# Altium schematic sheet MIC&Speaker.SchDoc
size A4
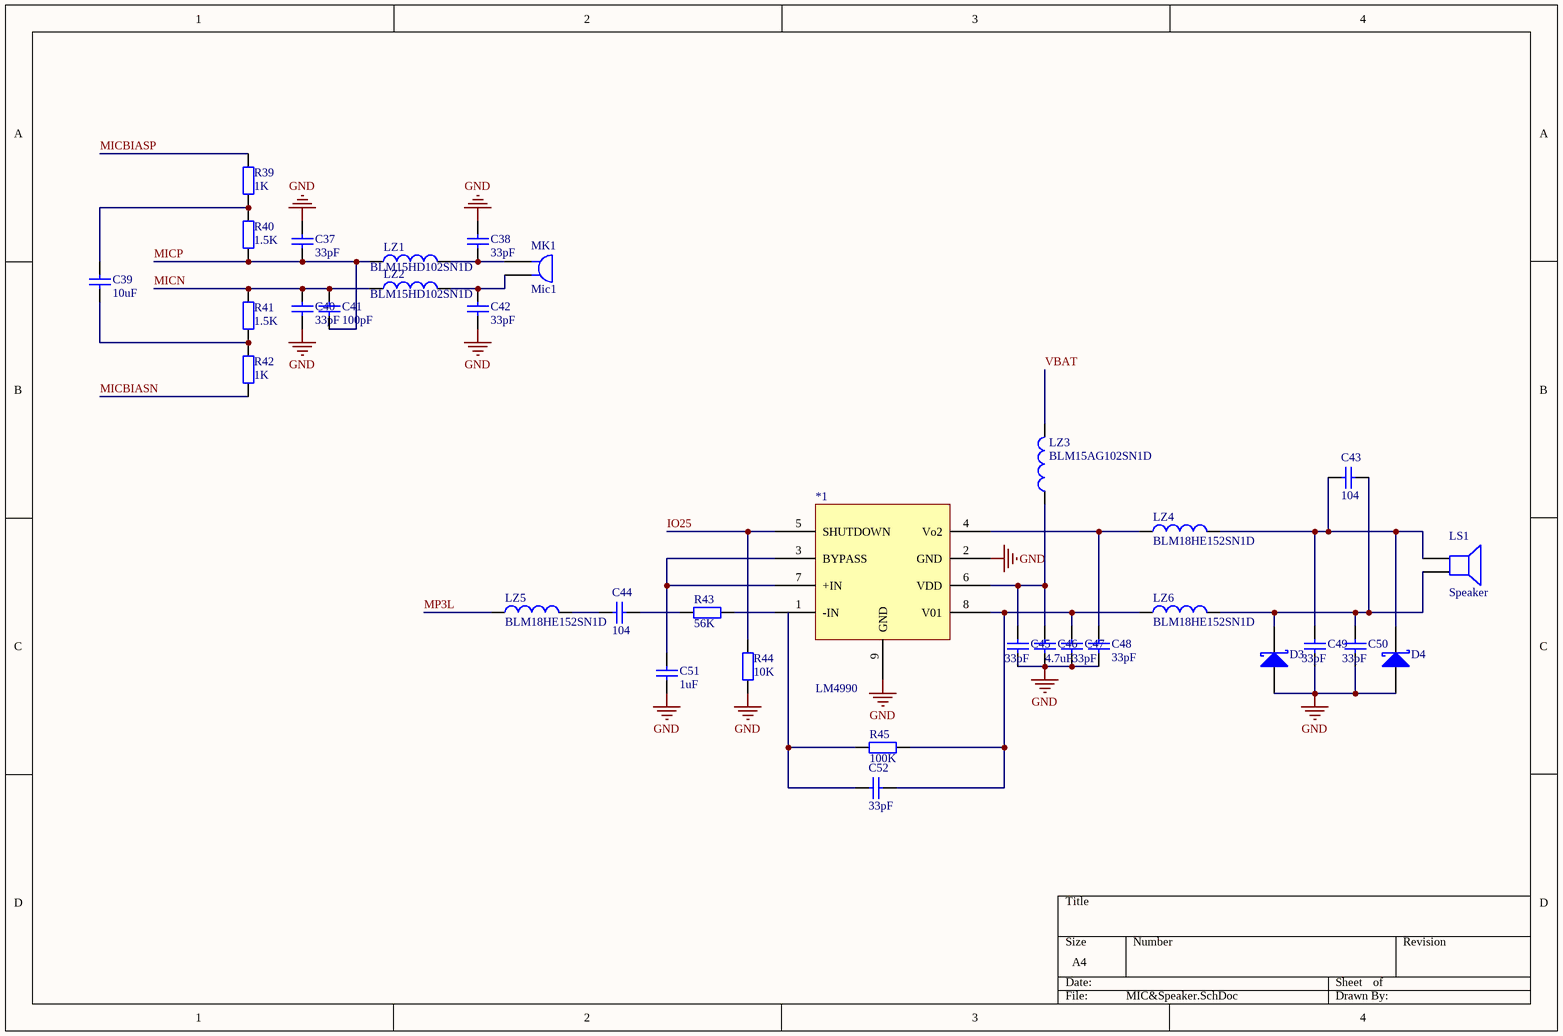
[diagram p0: MIC&Speaker.SchDoc]

## Parts
*1  LM4990
C37  value 33pF  [1608[0603]]  (hidden comment: Cap)
C38  value 33pF  [1608[0603]]  (hidden comment: Cap)
C39  value 10uF  [1608[0603]]  (hidden comment: Cap)
C40  value 33pF  [1608[0603]]  (hidden comment: Cap)
C41  value 100pF  [1608[0603]]  (hidden comment: Cap)
C42  value 33pF  [1608[0603]]  (hidden comment: Cap)
C43  value 104  [1608[0603]]  (hidden comment: Cap)
C44  value 104  [1608[0603]]  (hidden comment: Cap)
C45  value 33pF  [1608[0603]]  (hidden comment: Cap)
C46  value 4.7uF  [1608[0603]]  (hidden comment: Cap)
C47  value 33pF  [1608[0603]]  (hidden comment: Cap)
C48  value 33pF  [1608[0603]]  (hidden comment: Cap)
C49  value 33pF  [1608[0603]]  (hidden comment: Cap)
C50  value 33pF  [1608[0603]]  (hidden comment: Cap)
C51  value 1uF  [1608[0603]]  (hidden comment: Cap)
C52  value 33pF  [1608[0603]]  (hidden comment: Cap)
D3  Diode BAT17  [SOT-23]  (value not drawn)
D4  Diode BAT17  [SOT-23]  (value not drawn)
LS1  Speaker  [PIN2]
LZ1  Inductor  [0402-A]  (value not drawn)
LZ2  Inductor  [0402-A]  (value not drawn)
LZ3  BLM15AG102SN1D  [0402-A]
LZ4  BLM18HE152SN1D  [0402-A]
LZ5  BLM18HE152SN1D  [0402-A]
LZ6  BLM18HE152SN1D  [0402-A]
MK1  Mic1  [PIN2]
R39  value 1K  [1608[0603]]  (hidden comment: Res)
R40  value 1.5K  [1608[0603]]  (hidden comment: Res)
R41  value 1.5K  [1608[0603]]  (hidden comment: Res)
R42  value 1K  [1608[0603]]  (hidden comment: Res)
R43  value 56K  [1608[0603]]  (hidden comment: Res)
R44  value 10K  [1608[0603]]  (hidden comment: Res)
R45  value 100K  [1608[0603]]  (hidden comment: Res)

## Nets
GND: *1.2(GND) *1.9(GND) C37.2 C38.2 C40.1 C42.1 C45.2 C46.2 C47.2 C49.2 C50.2 C51.2 D3.1(A) D4.1(A) R44.1
IO25: *1.5(SHUTDOWN) R44.2
MICBIASN: R42.1
MICBIASP: R39.2
MICN: C40.2 C41.2 LZ2.1 R41.2
MICP: C37.1 C41.1 LZ1.1 R40.1
MP3L: LZ5.1
VBAT: LZ3.2
Net*1_1: *1.1(-IN) R43.1
Net*1_3: *1.3(BYPASS) *1.7(+IN) C51.1
Net*1_4: *1.4(Vo2) C48.1 LZ4.1
Net*1_6: *1.6(VDD) C45.1 C46.1 LZ3.1
Net*1_8: *1.8(V01) C47.1 C52.1 LZ6.1 R45.1
NetC38_1: C38.1 LZ1.2 MK1.1
NetC39_1: C39.1 R41.1 R42.2
NetC39_2: C39.2 R39.1 R40.2
NetC42_2: C42.2 LZ2.2 MK1.2
NetC43_1: C43.1 C50.1 D3.3(K) LS1.2 LZ6.2
NetC43_2: C43.2 C49.1 D4.3(K) LS1.1 LZ4.2
NetC44_1: C44.1 R43.2
NetC44_2: C44.2 LZ5.2
NetC52_2: C52.2 R45.2

Not connected (* = marked no-connect by the designer): C48 2

## Notes on the sheet
- (in symbol Inductor) BLM15HD102SN1D

## Library data of the parts
C37-C52 = Cap: Capacitor; Published: 8-Jun-2000; LatestRevisionDate: 17-Jul-2002; LatestRevisionNote: Re-released for DXP Platform.; Publisher: Altium Limited
D3 D4 = Diode BAT17: Silicon RF Schottky Diode for Mixer Applications in the VHF/UHF Range; Note: Pin 2 is not connected and not drawn.; Published: 21-Mar-2003; DatasheetDocument: Oct-1999; PackageDocument: Sep-2001; PackageReference: SOT-23; Publisher: Altium Limited; ComponentLink1Description: Manufacturer Link; ComponentLink1URL: http://www.infineon.com/; ComponentLink2Description: Datasheet; ComponentLink2URL: http://www.infineon.com/upload/Document/cmc_upload/documents/009/363/bat17series.pdf
LS1 = Speaker: Loudspeaker; Published: 24-Mar-1999; LatestRevisionDate: 17-Jul-2002; LatestRevisionNote: Re-released for DXP Platform.; PackageReference: PIN2; Publisher: Altium Limited
LZ1-LZ6 = Inductor: Code_IEC: 1005; Value: 10mH; Published: 8-Jun-2000; LatestRevisionDate: 17-Jul-2002; LatestRevisionNote: Re-released for DXP Platform.; PackageReference: 0402-A; Publisher: Altium Limited; Code_JEITA: 0402
MK1 = Mic1: Microphone; Published: 24-Mar-1999; LatestRevisionDate: 17-Jul-2002; LatestRevisionNote: Re-released for DXP Platform.; PackageReference: PIN2; Publisher: Altium Limited
R39-R45 = RES: Resistor; Published: 8-Jun-2000; LatestRevisionDate: 17-Jul-2002; LatestRevisionNote: Re-released for DXP Platform.; Publisher: Altium Limited